# Altium schematic sheet Master.SchDoc
size A; SheetNumber: 1; SheetTotal: 5
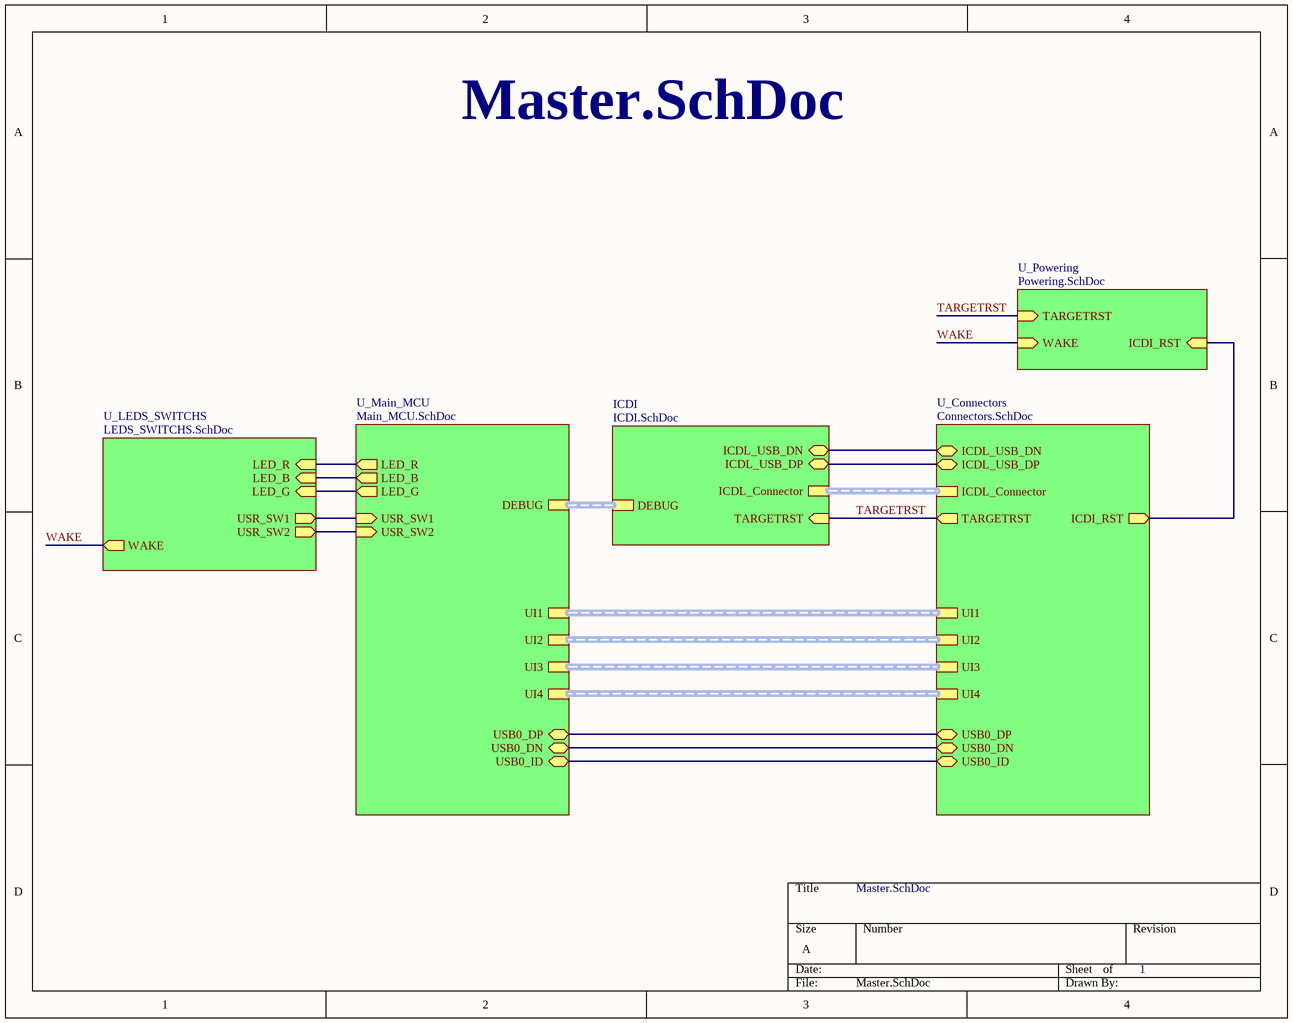
[diagram p0: Master.SchDoc]

## Sub-sheets
ICDI = ICDI.SchDoc: ICDL_USB_DN (bidir), ICDL_USB_DP (bidir), DEBUG (harness DEBUG), TARGETRST (in), ICDL_Connector (harness ICDL)
U_Connectors = Connectors.SchDoc: USB0_DN (bidir), USB0_DP (bidir), USB0_ID (bidir), ICDL_USB_DN (bidir), ICDL_USB_DP (bidir), ICDL_Connector (harness ICDL), ICDI_RST (out), UI1 (harness UI1), UI2 (harness UI2), UI3 (harness UI3), UI4 (harness UI4), TARGETRST (out)
U_LEDS_SWITCHS = LEDS_SWITCHS.SchDoc: USR_SW2 (out), LED_R (in), LED_B (in), LED_G (in), USR_SW1 (out), WAKE (out)
U_Main_MCU = Main_MCU.SchDoc: USR_SW2 (in), LED_R (out), LED_B (out), LED_G (out), USR_SW1 (in), USB0_DN (bidir), USB0_DP (bidir), USB0_ID (bidir), DEBUG (harness DEBUG), UI1 (harness UI1), UI2 (harness UI2), UI3 (harness UI3), UI4 (harness UI4)
U_Powering = Powering.SchDoc: WAKE (in), TARGETRST (in), ICDI_RST (in)

## Nets
TARGETRST: sheet U_Connectors/TARGETRST, sheet ICDI/TARGETRST, sheet U_Powering/TARGETRST
WAKE: sheet U_LEDS_SWITCHS/WAKE, sheet U_Powering/WAKE
(unnamed): sheet U_Main_MCU/USR_SW2, sheet U_LEDS_SWITCHS/USR_SW2
(unnamed): sheet U_Main_MCU/LED_R, sheet U_LEDS_SWITCHS/LED_R
(unnamed): sheet U_Main_MCU/LED_B, sheet U_LEDS_SWITCHS/LED_B
(unnamed): sheet U_Main_MCU/LED_G, sheet U_LEDS_SWITCHS/LED_G
(unnamed): sheet U_Main_MCU/USR_SW1, sheet U_LEDS_SWITCHS/USR_SW1
(unnamed): sheet U_Main_MCU/USB0_DN, sheet U_Connectors/USB0_DN
(unnamed): sheet U_Main_MCU/USB0_DP, sheet U_Connectors/USB0_DP
(unnamed): sheet U_Main_MCU/USB0_ID, sheet U_Connectors/USB0_ID
(unnamed): sheet U_Connectors/ICDL_USB_DN, sheet ICDI/ICDL_USB_DN
(unnamed): sheet U_Connectors/ICDL_USB_DP, sheet ICDI/ICDL_USB_DP
(unnamed): sheet U_Connectors/ICDI_RST, sheet U_Powering/ICDI_RST

## Buses and harness runs
harness sheet ICDI/DEBUG = sheet U_Main_MCU/DEBUG
harness sheet ICDI/ICDL_Connector = sheet U_Connectors/ICDL_Connector
harness sheet U_Connectors/UI1 = sheet U_Main_MCU/UI1
harness sheet U_Connectors/UI2 = sheet U_Main_MCU/UI2
harness sheet U_Connectors/UI3 = sheet U_Main_MCU/UI3
harness sheet U_Connectors/UI4 = sheet U_Main_MCU/UI4